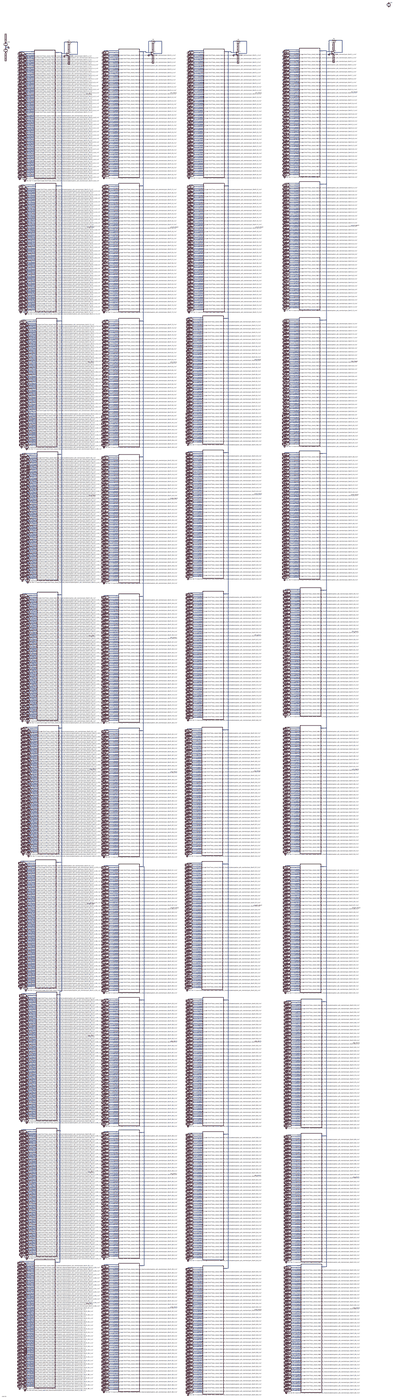
[diagram p0: schematic bangla_font_pattern.asc, whole sheet]
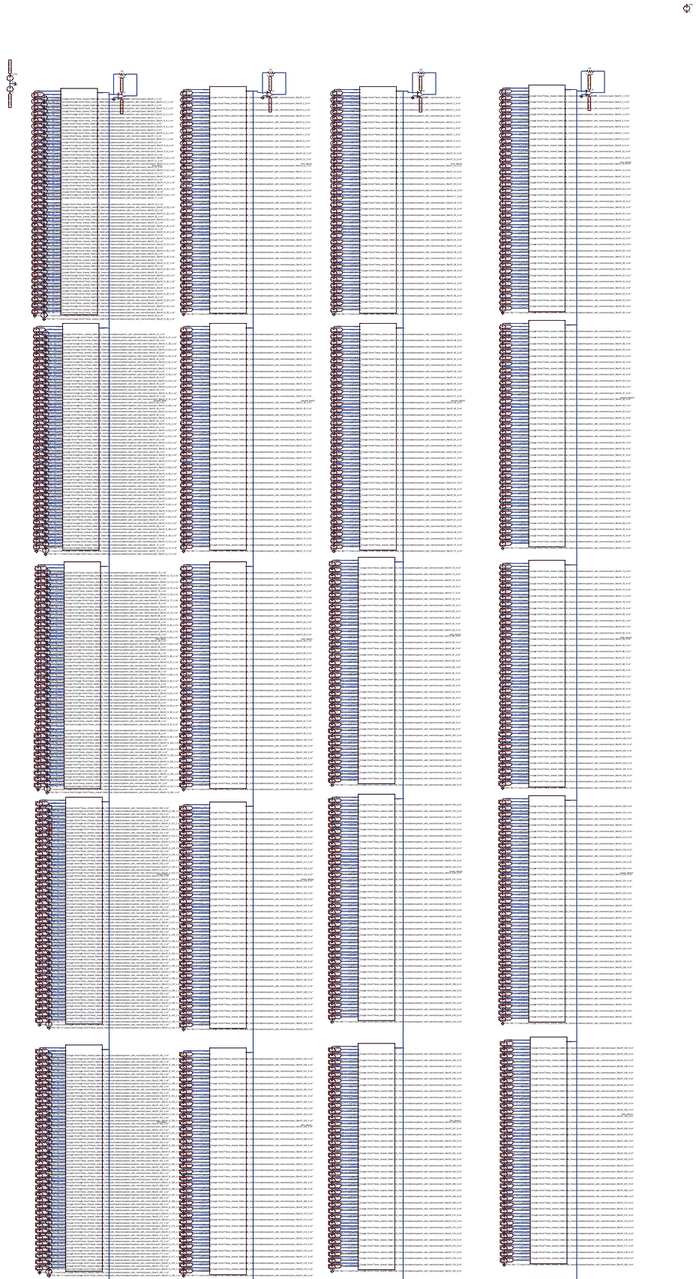
[diagram p1: schematic bangla_font_pattern.asc, part, row 1 of 2, column 1 of 1]
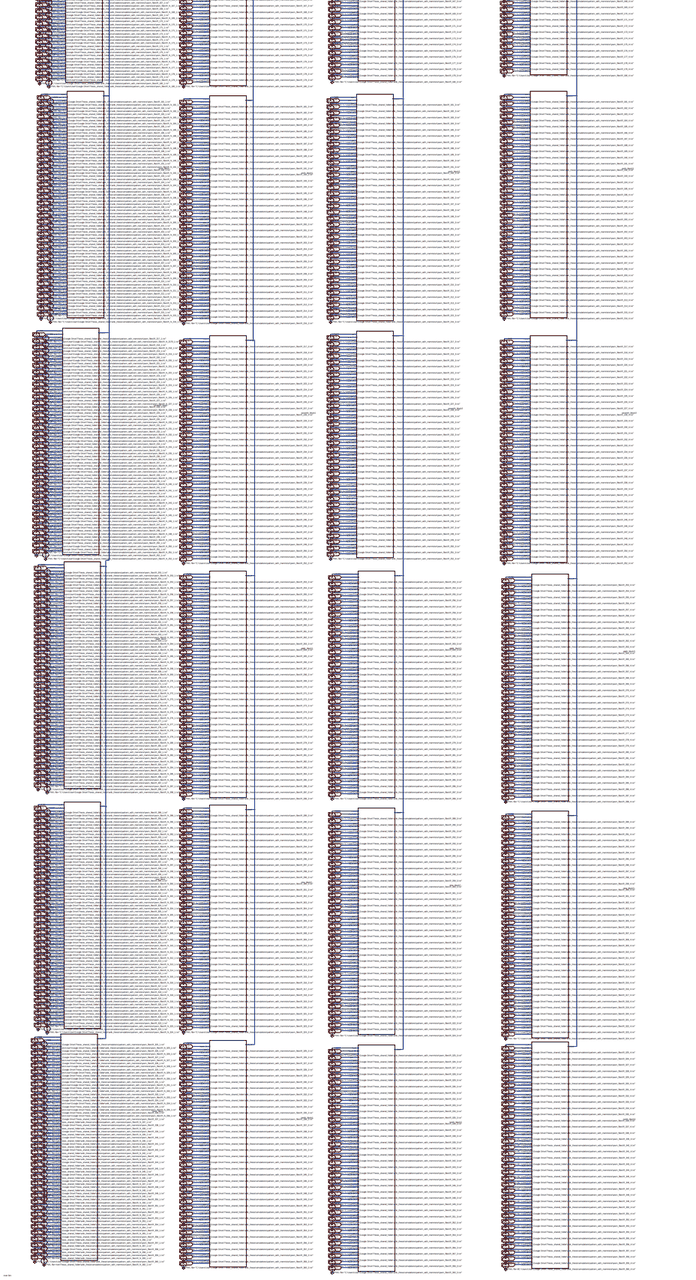
[diagram p2: schematic bangla_font_pattern.asc, part, row 2 of 2, column 1 of 1]
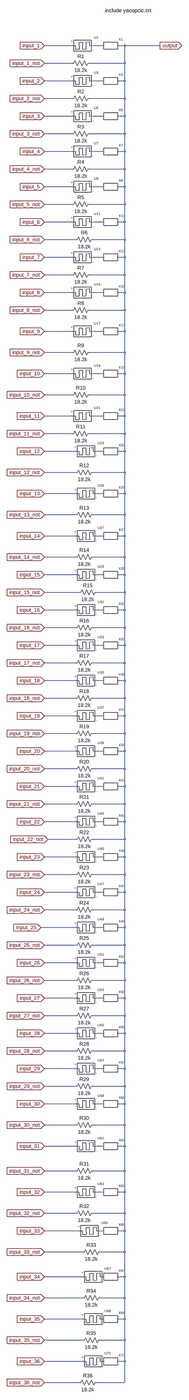
[diagram p3: sub-circuit memristor_block.asc, whole sheet]
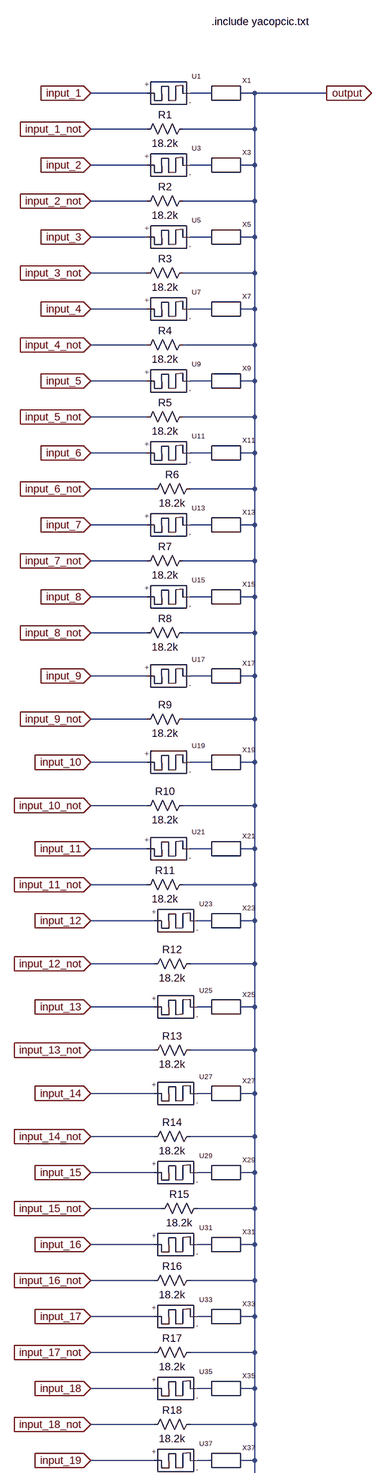
[diagram p4: sub-circuit memristor_block.asc, part, row 1 of 2, column 1 of 1]
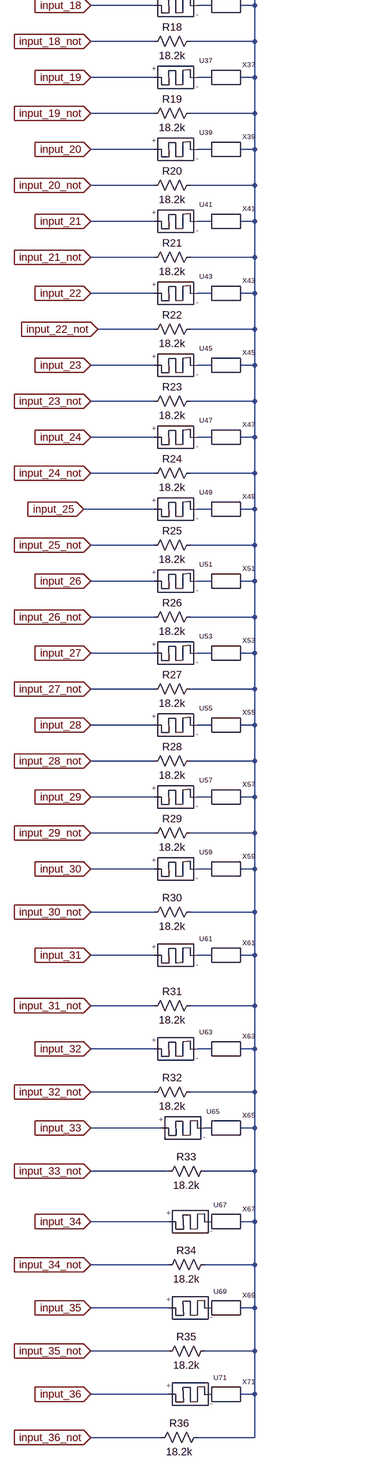
[diagram p5: sub-circuit memristor_block.asc, part, row 2 of 2, column 1 of 1]
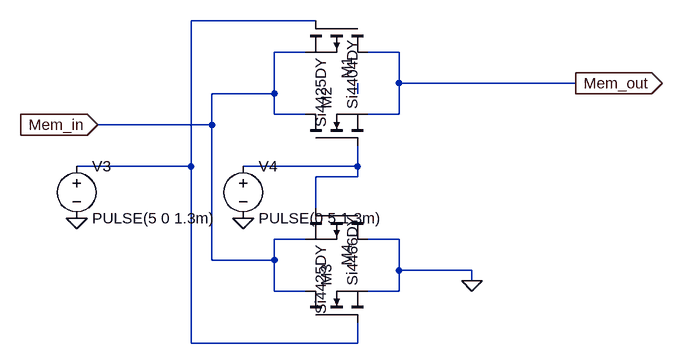
[diagram p6: sub-circuit programmer_with_transmission.asc]
* bangla_font_pattern.asc
Xfirst_block N012 351_NOT N016 2_NOT N020 3_NOT N024 4_NOT N028 5_NOT N032 6_NOT N036 7_NOT N040 8_NOT N007 N044 9_NOT N048 10_NOT N052 11_NOT N056 12_NOT N060 13_NOT N064 14_NOT N068 15_NOT N072 16_NOT N076 17_NOT N080 18_NOT N084 19_NOT N088 20_NOT N092 21_NOT N096 22_NOT N100 23_NOT N104 24_NOT N108 25_NOT N112 26_NOT N116 27_NOT N120 28_NOT N124 29_NOT N128 30_NOT N132 31_NOT N136 32_NOT N140 33_NOT N144 34_NOT N148 35_NOT N152 36_NOT memristor_block
V1 N012 0 PWL file="C:\Users\Anik\Google Drive\Thesis_shared_folder\anik_thesis\simulations\pattern_with_memristor\pwm_files\R_1_1.txt"
V2 351_NOT 0 PWL file="C:\Users\Anik\Google Drive\Thesis_shared_folder\anik_thesis\simulations\pattern_with_memristor\pwm_files\R_N_1_1.txt"
V3 N016 0 PWL file="C:\Users\Anik\Google Drive\Thesis_shared_folder\anik_thesis\simulations\pattern_with_memristor\pwm_files\R_2_1.txt"
V4 2_NOT 0 PWL file="C:\Users\Anik\Google Drive\Thesis_shared_folder\anik_thesis\simulations\pattern_with_memristor\pwm_files\R_N_2_1.txt"
V5 N020 0 PWL file="C:\Users\Anik\Google Drive\Thesis_shared_folder\anik_thesis\simulations\pattern_with_memristor\pwm_files\R_3_1.txt"
V6 3_NOT 0 PWL file="C:\Users\Anik\Google Drive\Thesis_shared_folder\anik_thesis\simulations\pattern_with_memristor\pwm_files\R_N_3_1.txt"
V7 N024 0 PWL file="C:\Users\Anik\Google Drive\Thesis_shared_folder\anik_thesis\simulations\pattern_with_memristor\pwm_files\R_4_1.txt"
V8 4_NOT 0 PWL file="C:\Users\Anik\Google Drive\Thesis_shared_folder\anik_thesis\simulations\pattern_with_memristor\pwm_files\R_N_4_1.txt"
V9 N028 0 PWL file="C:\Users\Anik\Google Drive\Thesis_shared_folder\anik_thesis\simulations\pattern_with_memristor\pwm_files\R_5_1.txt"
V10 5_NOT 0 PWL file="C:\Users\Anik\Google Drive\Thesis_shared_folder\anik_thesis\simulations\pattern_with_memristor\pwm_files\R_N_5_1.txt"
V11 N032 0 PWL file="C:\Users\Anik\Google Drive\Thesis_shared_folder\anik_thesis\simulations\pattern_with_memristor\pwm_files\R_6_1.txt"
V12 6_NOT 0 PWL file="C:\Users\Anik\Google Drive\Thesis_shared_folder\anik_thesis\simulations\pattern_with_memristor\pwm_files\R_N_6_1.txt"
V13 N036 0 PWL file="C:\Users\Anik\Google Drive\Thesis_shared_folder\anik_thesis\simulations\pattern_with_memristor\pwm_files\R_7_1.txt"
V14 7_NOT 0 PWL file="C:\Users\Anik\Google Drive\Thesis_shared_folder\anik_thesis\simulations\pattern_with_memristor\pwm_files\R_N_7_1.txt"
V15 N040 0 PWL file="C:\Users\Anik\Google Drive\Thesis_shared_folder\anik_thesis\simulations\pattern_with_memristor\pwm_files\R_8_1.txt"
V16 8_NOT 0 PWL file="C:\Users\User\Google Drive\Thesis_shared_folder\anik_thesis\simulations\pattern_with_memristor\pwm_files\R_N_8_1.txt"
V17 N044 0 PWL file="C:\Users\Anik\Google Drive\Thesis_shared_folder\anik_thesis\simulations\pattern_with_memristor\pwm_files\R_9_1.txt"
V18 9_NOT 0 PWL file="C:\Users\User\Google Drive\Thesis_shared_folder\anik_thesis\simulations\pattern_with_memristor\pwm_files\R_N_9_1.txt"
V19 N048 0 PWL file="C:\Users\Anik\Google Drive\Thesis_shared_folder\anik_thesis\simulations\pattern_with_memristor\pwm_files\R_10_1.txt"
V20 10_NOT 0 PWL file="C:\Users\User\Google Drive\Thesis_shared_folder\anik_thesis\simulations\pattern_with_memristor\pwm_files\R_N_10_1.txt"
V21 N052 0 PWL file="C:\Users\Anik\Google Drive\Thesis_shared_folder\anik_thesis\simulations\pattern_with_memristor\pwm_files\R_11_1.txt"
V22 11_NOT 0 PWL file="C:\Users\User\Google Drive\Thesis_shared_folder\anik_thesis\simulations\pattern_with_memristor\pwm_files\R_N_11_1.txt"
V23 N056 0 PWL file="C:\Users\Anik\Google Drive\Thesis_shared_folder\anik_thesis\simulations\pattern_with_memristor\pwm_files\R_12_1.txt"
V24 12_NOT 0 PWL file="C:\Users\User\Google Drive\Thesis_shared_folder\anik_thesis\simulations\pattern_with_memristor\pwm_files\R_N_12_1.txt"
V25 N060 0 PWL file="C:\Users\Anik\Google Drive\Thesis_shared_folder\anik_thesis\simulations\pattern_with_memristor\pwm_files\R_13_1.txt"
V26 13_NOT 0 PWL file="C:\Users\User\Google Drive\Thesis_shared_folder\anik_thesis\simulations\pattern_with_memristor\pwm_files\R_N_13_1.txt"
V27 N064 0 PWL file="C:\Users\Anik\Google Drive\Thesis_shared_folder\anik_thesis\simulations\pattern_with_memristor\pwm_files\R_14_1.txt"
V28 14_NOT 0 PWL file="C:\Users\User\Google Drive\Thesis_shared_folder\anik_thesis\simulations\pattern_with_memristor\pwm_files\R_N_14_1.txt"
V29 N068 NC_01 PWL file="C:\Users\Anik\Google Drive\Thesis_shared_folder\anik_thesis\simulations\pattern_with_memristor\pwm_files\R_15_1.txt"
V30 15_NOT NC_02 PWL file="C:\Users\User\Google Drive\Thesis_shared_folder\anik_thesis\simulations\pattern_with_memristor\pwm_files\R_N_15_1.txt"
V31 N072 0 PWL file="C:\Users\User\Google Drive\Thesis_shared_folder\anik_thesis\simulations\pattern_with_memristor\pwm_files\R_16_1.txt"
V32 16_NOT 0 PWL file="C:\Users\User\Google Drive\Thesis_shared_folder\anik_thesis\simulations\pattern_with_memristor\pwm_files\R_N_16_1.txt"
V33 N076 0 PWL file="C:\Users\User\Google Drive\Thesis_shared_folder\anik_thesis\simulations\pattern_with_memristor\pwm_files\R_17_1.txt"
V34 17_NOT 0 V
V35 N080 NC_03 PWL file="C:\Users\User\Google Drive\Thesis_shared_folder\anik_thesis\simulations\pattern_with_memristor\pwm_files\R_18_1.txt"
V36 18_NOT 0 PWL file="C:\Users\User\Google Drive\Thesis_shared_folder\anik_thesis\simulations\pattern_with_memristor\pwm_files\R_N_18_1.txt"
V37 N084 0 PWL file="C:\Users\User\Google Drive\Thesis_shared_folder\anik_thesis\simulations\pattern_with_memristor\pwm_files\R_19_1.txt"
V38 19_NOT 0 PWL file="C:\Users\User\Google Drive\Thesis_shared_folder\anik_thesis\simulations\pattern_with_memristor\pwm_files\R_N_19_1.txt"
V39 N088 0 PWL file="C:\Users\User\Google Drive\Thesis_shared_folder\anik_thesis\simulations\pattern_with_memristor\pwm_files\R_20_1.txt"
V40 20_NOT 0 PWL file="C:\Users\User\Google Drive\Thesis_shared_folder\anik_thesis\simulations\pattern_with_memristor\pwm_files\R_N_20_1.txt"
V41 N092 0 PWL file="C:\Users\User\Google Drive\Thesis_shared_folder\anik_thesis\simulations\pattern_with_memristor\pwm_files\R_21_1.txt"
V42 21_NOT 0 PWL file="C:\Users\User\Google Drive\Thesis_shared_folder\anik_thesis\simulations\pattern_with_memristor\pwm_files\R_N_21_1.txt"
V43 N096 0 PWL file="C:\Users\User\Google Drive\Thesis_shared_folder\anik_thesis\simulations\pattern_with_memristor\pwm_files\R_22_1.txt"
V44 22_NOT 0 PWL file="C:\Users\User\Google Drive\Thesis_shared_folder\anik_thesis\simulations\pattern_with_memristor\pwm_files\R_N_22_1.txt"
V45 N100 0 PWL file="C:\Users\User\Google Drive\Thesis_shared_folder\anik_thesis\simulations\pattern_with_memristor\pwm_files\R_23_1.txt"
V46 23_NOT 0 PWL file="C:\Users\User\Google Drive\Thesis_shared_folder\anik_thesis\simulations\pattern_with_memristor\pwm_files\R_N_23_1.txt"
V47 N104 0 PWL file="C:\Users\User\Google Drive\Thesis_shared_folder\anik_thesis\simulations\pattern_with_memristor\pwm_files\R_24_1.txt"
V48 24_NOT 0 PWL file="C:\Users\User\Google Drive\Thesis_shared_folder\anik_thesis\simulations\pattern_with_memristor\pwm_files\R_N_24_1.txt"
V49 N108 0 PWL file="C:\Users\User\Google Drive\Thesis_shared_folder\anik_thesis\simulations\pattern_with_memristor\pwm_files\R_25_1.txt"
V50 25_NOT 0 PWL file="C:\Users\User\Google Drive\Thesis_shared_folder\anik_thesis\simulations\pattern_with_memristor\pwm_files\R_N_25_1.txt"
V51 N112 0 PWL file="C:\Users\User\Google Drive\Thesis_shared_folder\anik_thesis\simulations\pattern_with_memristor\pwm_files\R_26_1.txt"
V52 26_NOT 0 PWL file="C:\Users\User\Google Drive\Thesis_shared_folder\anik_thesis\simulations\pattern_with_memristor\pwm_files\R_N_26_1.txt"
V53 N116 0 PWL file="C:\Users\User\Google Drive\Thesis_shared_folder\anik_thesis\simulations\pattern_with_memristor\pwm_files\R_27_1.txt"
V54 27_NOT 0 PWL file="C:\Users\User\Google Drive\Thesis_shared_folder\anik_thesis\simulations\pattern_with_memristor\pwm_files\R_N_27_1.txt"
V55 N120 0 PWL file="C:\Users\User\Google Drive\Thesis_shared_folder\anik_thesis\simulations\pattern_with_memristor\pwm_files\R_28_1.txt"
V56 28_NOT 0 PWL file="C:\Users\User\Google Drive\Thesis_shared_folder\anik_thesis\simulations\pattern_with_memristor\pwm_files\R_N_28_1.txt"
V57 N124 0 PWL file="C:\Users\User\Google Drive\Thesis_shared_folder\anik_thesis\simulations\pattern_with_memristor\pwm_files\R_29_1.txt"
V58 29_NOT 0 PWL file="C:\Users\User\Google Drive\Thesis_shared_folder\anik_thesis\simulations\pattern_with_memristor\pwm_files\R_N_29_1.txt"
V59 N128 0 PWL file="C:\Users\User\Google Drive\Thesis_shared_folder\anik_thesis\simulations\pattern_with_memristor\pwm_files\R_30_1.txt"
V60 30_NOT 0 PWL file="C:\Users\User\Google Drive\Thesis_shared_folder\anik_thesis\simulations\pattern_with_memristor\pwm_files\R_N_30_1.txt"
V61 N132 0 PWL file="C:\Users\User\Google Drive\Thesis_shared_folder\anik_thesis\simulations\pattern_with_memristor\pwm_files\R_31_1.txt"
V62 31_NOT 0 PWL file="C:\Users\User\Google Drive\Thesis_shared_folder\anik_thesis\simulations\pattern_with_memristor\pwm_files\R_N_31_1.txt"
V63 N136 0 PWL file="C:\Users\User\Google Drive\Thesis_shared_folder\anik_thesis\simulations\pattern_with_memristor\pwm_files\R_32_1.txt"
V64 32_NOT 0 PWL file="C:\Users\User\Google Drive\Thesis_shared_folder\anik_thesis\simulations\pattern_with_memristor\pwm_files\R_N_32_1.txt"
V65 N140 0 PWL file="C:\Users\User\Google Drive\Thesis_shared_folder\anik_thesis\simulations\pattern_with_memristor\pwm_files\R_33_1.txt"
V66 33_NOT 0 PWL file="C:\Users\User\Google Drive\Thesis_shared_folder\anik_thesis\simulations\pattern_with_memristor\pwm_files\R_N_33_1.txt"
V67 N144 0 PWL file="C:\Users\User\Google Drive\Thesis_shared_folder\anik_thesis\simulations\pattern_with_memristor\pwm_files\R_34_1.txt"
V68 34_NOT 0 PWL file="C:\Users\User\Google Drive\Thesis_shared_folder\anik_thesis\simulations\pattern_with_memristor\pwm_files\R_N_34_1.txt"
V69 NC_04 NC_05 V
V70 N148 0 PWL file="C:\Users\User\Google Drive\Thesis_shared_folder\anik_thesis\simulations\pattern_with_memristor\pwm_files\R_35_1.txt"
V71 35_NOT 0 PWL file="C:\Users\User\Google Drive\Thesis_shared_folder\anik_thesis\simulations\pattern_with_memristor\pwm_files\R_N_35_1.txt"
V72 N152 0 PWL file="C:\Users\User\Google Drive\Thesis_shared_folder\anik_thesis\simulations\pattern_with_memristor\pwm_files\R_36_1.txt"
V73 36_NOT 0 PWL file="C:\Users\User\Google Drive\Thesis_shared_folder\anik_thesis\simulations\pattern_with_memristor\pwm_files\R_N_36_1.txt"
Xsecond_block N154 37_NOT N158 38_NOT N162 39_NOT N166 40_NOT N170 41_NOT N174 42_NOT N178 43_NOT N182 44_NOT N007 N186 45_NOT N190 46_NOT N194 47_NOT N198 48_NOT N202 49_NOT N206 50_NOT N210 51_NOT N214 52_NOT N218 53_NOT N222 54_NOT N226 55_NOT N230 56_NOT N234 57_NOT N238 58_NOT N242 59_NOT N246 60_NOT N250 61_NOT N254 62_NOT N258 63_NOT N262 64_NOT N266 65_NOT N270 66_NOT N274 67_NOT N278 68_NOT N282 69_NOT N286 70_NOT N290 71_NOT N294 72_NOT memristor_block
V74 N154 0 PWL file="C:\Users\User\Google Drive\Thesis_shared_folder\anik_thesis\simulations\pattern_with_memristor\pwm_files\R_37_1.txt"
V75 37_NOT 0 PWL file="C:\Users\User\Google Drive\Thesis_shared_folder\anik_thesis\simulations\pattern_with_memristor\pwm_files\R_N_37_1.txt"
V76 N158 0 PWL file="C:\Users\User\Google Drive\Thesis_shared_folder\anik_thesis\simulations\pattern_with_memristor\pwm_files\R_38_1.txt"
V77 38_NOT 0 PWL file="C:\Users\User\Google Drive\Thesis_shared_folder\anik_thesis\simulations\pattern_with_memristor\pwm_files\R_N_38_1.txt"
V78 N162 0 PWL file="C:\Users\User\Google Drive\Thesis_shared_folder\anik_thesis\simulations\pattern_with_memristor\pwm_files\R_39_1.txt"
V79 39_NOT 0 PWL file="C:\Users\User\Google Drive\Thesis_shared_folder\anik_thesis\simulations\pattern_with_memristor\pwm_files\R_N_39_1.txt"
V80 N166 0 PWL file="C:\Users\User\Google Drive\Thesis_shared_folder\anik_thesis\simulations\pattern_with_memristor\pwm_files\R_40_1.txt"
V81 40_NOT 0 PWL file="C:\Users\User\Google Drive\Thesis_shared_folder\anik_thesis\simulations\pattern_with_memristor\pwm_files\R_N_40_1.txt"
V82 N170 0 PWL file="C:\Users\User\Google Drive\Thesis_shared_folder\anik_thesis\simulations\pattern_with_memristor\pwm_files\R_41_1.txt"
V83 41_NOT 0 PWL file="C:\Users\User\Google Drive\Thesis_shared_folder\anik_thesis\simulations\pattern_with_memristor\pwm_files\R_N_41_1.txt"
V84 N174 0 PWL file="C:\Users\User\Google Drive\Thesis_shared_folder\anik_thesis\simulations\pattern_with_memristor\pwm_files\R_42_1.txt"
V85 42_NOT 0 PWL file="C:\Users\User\Google Drive\Thesis_shared_folder\anik_thesis\simulations\pattern_with_memristor\pwm_files\R_N_42_1.txt"
V86 N178 0 PWL file="C:\Users\User\Google Drive\Thesis_shared_folder\anik_thesis\simulations\pattern_with_memristor\pwm_files\R_43_1.txt"
V87 43_NOT 0 PWL file="C:\Users\User\Google Drive\Thesis_shared_folder\anik_thesis\simulations\pattern_with_memristor\pwm_files\R_N_43_1.txt"
V88 N182 0 PWL file="C:\Users\User\Google Drive\Thesis_shared_folder\anik_thesis\simulations\pattern_with_memristor\pwm_files\R_44_1.txt"
V89 44_NOT 0 PWL file="C:\Users\User\Google Drive\Thesis_shared_folder\anik_thesis\simulations\pattern_with_memristor\pwm_files\R_N_44_1.txt"
V90 N186 0 PWL file="C:\Users\User\Google Drive\Thesis_shared_folder\anik_thesis\simulations\pattern_with_memristor\pwm_files\R_45_1.txt"
V91 45_NOT 0 PWL file="C:\Users\User\Google Drive\Thesis_shared_folder\anik_thesis\simulations\pattern_with_memristor\pwm_files\R_N_45_1.txt"
V92 N190 0 PWL file="C:\Users\User\Google Drive\Thesis_shared_folder\anik_thesis\simulations\pattern_with_memristor\pwm_files\R_46_1.txt"
V93 46_NOT 0 PWL file="C:\Users\User\Google Drive\Thesis_shared_folder\anik_thesis\simulations\pattern_with_memristor\pwm_files\R_N_46_1.txt"
V94 N194 0 PWL file="C:\Users\User\Google Drive\Thesis_shared_folder\anik_thesis\simulations\pattern_with_memristor\pwm_files\R_4\7_1.txt"
V95 47_NOT 0 PWL file="C:\Users\User\Google Drive\Thesis_shared_folder\anik_thesis\simulations\pattern_with_memristor\pwm_files\R_N_47_1.txt"
V96 N198 0 PWL file="C:\Users\User\Google Drive\Thesis_shared_folder\anik_thesis\simulations\pattern_with_memristor\pwm_files\R_48_1.txt"
V97 48_NOT 0 PWL file="C:\Users\User\Google Drive\Thesis_shared_folder\anik_thesis\simulations\pattern_with_memristor\pwm_files\R_N_48_1.txt"
V98 N202 0 PWL file="C:\Users\User\Google Drive\Thesis_shared_folder\anik_thesis\simulations\pattern_with_memristor\pwm_files\R_49_1.txt"
V99 49_NOT 0 PWL file="C:\Users\User\Google Drive\Thesis_shared_folder\anik_thesis\simulations\pattern_with_memristor\pwm_files\R_N_49_1.txt"
V100 N206 0 PWL file="C:\Users\User\Google Drive\Thesis_shared_folder\anik_thesis\simulations\pattern_with_memristor\pwm_files\R_50_1.txt"
V101 50_NOT 0 PWL file="C:\Users\User\Google Drive\Thesis_shared_folder\anik_thesis\simulations\pattern_with_memristor\pwm_files\R_N_50_1.txt"
V102 N210 NC_06 PWL file="C:\Users\User\Google Drive\Thesis_shared_folder\anik_thesis\simulations\pattern_with_memristor\pwm_files\R_51_1.txt"
V103 51_NOT NC_07 PWL file="C:\Users\User\Google Drive\Thesis_shared_folder\anik_thesis\simulations\pattern_with_memristor\pwm_files\R_N_51_1.txt"
V104 N214 0 PWL file="C:\Users\User\Google Drive\Thesis_shared_folder\anik_thesis\simulations\pattern_with_memristor\pwm_files\R_52_1.txt"
V105 52_NOT 0 PWL file="C:\Users\User\Google Drive\Thesis_shared_folder\anik_thesis\simulations\pattern_with_memristor\pwm_files\R_N_52_1.txt"
V106 N218 0 PWL file="C:\Users\User\Google Drive\Thesis_shared_folder\anik_thesis\simulations\pattern_with_memristor\pwm_files\R_53_1.txt"
V107 53_NOT 0 PWL file="C:\Users\User\Google Drive\Thesis_shared_folder\anik_thesis\simulations\pattern_with_memristor\pwm_files\R_N_53_1.txt"
V108 N222 NC_08 PWL file="C:\Users\User\Google Drive\Thesis_shared_folder\anik_thesis\simulations\pattern_with_memristor\pwm_files\R_54_1.txt"
V109 54_NOT 0 PWL file="C:\Users\User\Google Drive\Thesis_shared_folder\anik_thesis\simulations\pattern_with_memristor\pwm_files\R_N_54_1.txt"
V110 N226 0 PWL file="C:\Users\User\Google Drive\Thesis_shared_folder\anik_thesis\simulations\pattern_with_memristor\pwm_files\R_55_1.txt"
V111 55_NOT 0 PWL file="C:\Users\User\Google Drive\Thesis_shared_folder\anik_thesis\simulations\pattern_with_memristor\pwm_files\R_N_55_1.txt"
V112 N230 0 PWL file="C:\Users\User\Google Drive\Thesis_shared_folder\anik_thesis\simulations\pattern_with_memristor\pwm_files\R_56_1.txt"
V113 56_NOT 0 PWL file="C:\Users\User\Google Drive\Thesis_shared_folder\anik_thesis\simulations\pattern_with_memristor\pwm_files\R_N_56_1.txt"
V114 N234 0 PWL file="C:\Users\User\Google Drive\Thesis_shared_folder\anik_thesis\simulations\pattern_with_memristor\pwm_files\R_57_1.txt"
V115 57_NOT 0 PWL file="C:\Users\User\Google Drive\Thesis_shared_folder\anik_thesis\simulations\pattern_with_memristor\pwm_files\R_N_57_1.txt"
V116 N238 0 PWL file="C:\Users\User\Google Drive\Thesis_shared_folder\anik_thesis\simulations\pattern_with_memristor\pwm_files\R_58_1.txt"
V117 58_NOT 0 PWL file="C:\Users\User\Google Drive\Thesis_shared_folder\anik_thesis\simulations\pattern_with_memristor\pwm_files\R_N_58_1.txt"
V118 N242 0 PWL file="C:\Users\User\Google Drive\Thesis_shared_folder\anik_thesis\simulations\pattern_with_memristor\pwm_files\R_59_1.txt"
V119 59_NOT 0 PWL file="C:\Users\User\Google Drive\Thesis_shared_folder\anik_thesis\simulations\pattern_with_memristor\pwm_files\R_N_59_1.txt"
V120 N246 0 PWL file="C:\Users\User\Google Drive\Thesis_shared_folder\anik_thesis\simulations\pattern_with_memristor\pwm_files\R_60_1.txt"
V121 60_NOT 0 PWL file="C:\Users\User\Google Drive\Thesis_shared_folder\anik_thesis\simulations\pattern_with_memristor\pwm_files\R_N_60_1.txt"
V122 N250 0 PWL file="C:\Users\User\Google Drive\Thesis_shared_folder\anik_thesis\simulations\pattern_with_memristor\pwm_files\R_61_1.txt"
V123 61_NOT 0 PWL file="C:\Users\User\Google Drive\Thesis_shared_folder\anik_thesis\simulations\pattern_with_memristor\pwm_files\R_N_61_1.txt"
V124 N254 0 PWL file="C:\Users\User\Google Drive\Thesis_shared_folder\anik_thesis\simulations\pattern_with_memristor\pwm_files\R_62_1.txt"
V125 62_NOT 0 PWL file="C:\Users\User\Google Drive\Thesis_shared_folder\anik_thesis\simulations\pattern_with_memristor\pwm_files\R_N_62_1.txt"
V126 N258 0 PWL file="C:\Users\User\Google Drive\Thesis_shared_folder\anik_thesis\simulations\pattern_with_memristor\pwm_files\R_63_1.txt"
V127 63_NOT 0 PWL file="C:\Users\User\Google Drive\Thesis_shared_folder\anik_thesis\simulations\pattern_with_memristor\pwm_files\R_N_63_1.txt"
V128 N262 0 PWL file="C:\Users\User\Google Drive\Thesis_shared_folder\anik_thesis\simulations\pattern_with_memristor\pwm_files\R_64_1.txt"
V129 64_NOT 0 PWL file="C:\Users\User\Google Drive\Thesis_shared_folder\anik_thesis\simulations\pattern_with_memristor\pwm_files\R_N_64_1.txt"
V130 N266 0 PWL file="C:\Users\User\Google Drive\Thesis_shared_folder\anik_thesis\simulations\pattern_with_memristor\pwm_files\R_65_1.txt"
V131 65_NOT 0 PWL file="C:\Users\User\Google Drive\Thesis_shared_folder\anik_thesis\simulations\pattern_with_memristor\pwm_files\R_N_64_1.txt"
V132 N270 0 PWL file="C:\Users\User\Google Drive\Thesis_shared_folder\anik_thesis\simulations\pattern_with_memristor\pwm_files\R_66_1.txt"
V133 66_NOT 0 PWL file="C:\Users\User\Google Drive\Thesis_shared_folder\anik_thesis\simulations\pattern_with_memristor\pwm_files\R_N_66_1.txt"
V134 N274 0 PWL file="C:\Users\User\Google Drive\Thesis_shared_folder\anik_thesis\simulations\pattern_with_memristor\pwm_files\R_67_1.txt"
V135 67_NOT 0 PWL file="C:\Users\User\Google Drive\Thesis_shared_folder\anik_thesis\simulations\pattern_with_memristor\pwm_files\R_N_67_1.txt"
V136 N278 0 PWL file="C:\Users\User\Google Drive\Thesis_shared_folder\anik_thesis\simulations\pattern_with_memristor\pwm_files\R_68_1.txt"
V137 68_NOT 0 PWL file="C:\Users\User\Google Drive\Thesis_shared_folder\anik_thesis\simulations\pattern_with_memristor\pwm_files\R_N_68_1.txt"
V138 N282 0 PWL file="C:\Users\User\Google Drive\Thesis_shared_folder\anik_thesis\simulations\pattern_with_memristor\pwm_files\R_69_1.txt"
V139 69_NOT 0 PWL file="C:\Users\User\Google Drive\Thesis_shared_folder\anik_thesis\simulations\pattern_with_memristor\pwm_files\R_N_69_1.txt"
V140 N286 0 PWL file="C:\Users\User\Google Drive\Thesis_shared_folder\anik_thesis\simulations\pattern_with_memristor\pwm_files\R_70_1.txt"
V141 70_NOT 0 PWL file="C:\Users\User\Google Drive\Thesis_shared_folder\anik_thesis\simulations\pattern_with_memristor\pwm_files\R_N_70_1.txt"
V142 N290 0 PWL file="C:\Users\User\Google Drive\Thesis_shared_folder\anik_thesis\simulations\pattern_with_memristor\pwm_files\R_71_1.txt"
V143 71_NOT 0 PWL file="C:\Users\User\Google Drive\Thesis_shared_folder\anik_thesis\simulations\pattern_with_memristor\pwm_files\R_N_71_1.txt"
V144 N294 0 PWL file="C:\Users\User\Google Drive\Thesis_shared_folder\anik_thesis\simulations\pattern_with_memristor\pwm_files\R_72_1.txt"
V145 72_NOT 0 PWL file="C:\Users\User\Google Drive\Thesis_shared_folder\anik_thesis\simulations\pattern_with_memristor\pwm_files\R_N_72_1.txt"
Xthird_block N299 73_NOT N303 74_NOT N307 75_NOT N311 76_NOT N315 77_NOT N319 78_NOT N323 79_NOT N327 80_NOT N007 N331 81_NOT N335 82_NOT N339 83_NOT N343 84_NOT N347 85_NOT N351 86_NOT N355 87_NOT N359 88_NOT N363 89_NOT N367 90_NOT N371 91_NOT N375 92_NOT N379 93_NOT N383 94_NOT N387 95_NOT N391 96_NOT N395 97_NOT N399 98_NOT N403 99_NOT N407 100_NOT N411 101_NOT N415 102_NOT N419 103_NOT N423 104_NOT N427 105_NOT N431 106_NOT N435 107_NOT N439 108_NOT memristor_block
V146 N299 0 PWL file="C:\Users\User\Google Drive\Thesis_shared_folder\anik_thesis\simulations\pattern_with_memristor\pwm_files\R_73_1.txt"
V147 73_NOT 0 PWL file="C:\Users\User\Google Drive\Thesis_shared_folder\anik_thesis\simulations\pattern_with_memristor\pwm_files\R_N_73_1.txt"
V148 N303 0 PWL file="C:\Users\User\Google Drive\Thesis_shared_folder\anik_thesis\simulations\pattern_with_memristor\pwm_files\R_74_1.txt"
V149 74_NOT 0 PWL file="C:\Users\User\Google Drive\Thesis_shared_folder\anik_thesis\simulations\pattern_with_memristor\pwm_files\R_N_74_1.txt"
V150 N307 0 PWL file="C:\Users\User\Google Drive\Thesis_shared_folder\anik_thesis\simulations\pattern_with_memristor\pwm_files\R_75_1.txt"
V151 75_NOT 0 PWL file="C:\Users\User\Google Drive\Thesis_shared_folder\anik_thesis\simulations\pattern_with_memristor\pwm_files\R_N_75_1.txt"
V152 N311 0 PWL file="C:\Users\User\Google Drive\Thesis_shared_folder\anik_thesis\simulations\pattern_with_memristor\pwm_files\R_76_1.txt"
V153 76_NOT 0 PWL file="C:\Users\User\Google Drive\Thesis_shared_folder\anik_thesis\simulations\pattern_with_memristor\pwm_files\R_N_76_1.txt"
V154 N315 0 PWL file="C:\Users\User\Google Drive\Thesis_shared_folder\anik_thesis\simulations\pattern_with_memristor\pwm_files\R_77_1.txt"
V155 77_NOT 0 PWL file="C:\Users\User\Google Drive\Thesis_shared_folder\anik_thesis\simulations\pattern_with_memristor\pwm_files\R_N_77_1.txt"
V156 N319 0 PWL file="C:\Users\User\Google Drive\Thesis_shared_folder\anik_thesis\simulations\pattern_with_memristor\pwm_files\R_78_1.txt"
V157 78_NOT 0 PWL file="C:\Users\User\Google Drive\Thesis_shared_folder\anik_thesis\simulations\pattern_with_memristor\pwm_files\R_N_76_1.txt"
V158 N323 0 PWL file="C:\Users\User\Google Drive\Thesis_shared_folder\anik_thesis\simulations\pattern_with_memristor\pwm_files\R_79_1.txt"
V159 79_NOT 0 PWL file="C:\Users\User\Google Drive\Thesis_shared_folder\anik_thesis\simulations\pattern_with_memristor\pwm_files\R_N_79_1.txt"
V160 N327 0 PWL file="C:\Users\User\Google Drive\Thesis_shared_folder\anik_thesis\simulations\pattern_with_memristor\pwm_files\R_80_1.txt"
V161 80_NOT 0 PWL file="C:\Users\User\Google Drive\Thesis_shared_folder\anik_thesis\simulations\pattern_with_memristor\pwm_files\R_N_80_1.txt"
V162 N331 0 PWL file="C:\Users\User\Google Drive\Thesis_shared_folder\anik_thesis\simulations\pattern_with_memristor\pwm_files\R_81_1.txt"
V163 81_NOT 0 PWL file="C:\Users\User\Google Drive\Thesis_shared_folder\anik_thesis\simulations\pattern_with_memristor\pwm_files\R_N_81_1.txt"
V164 N335 0 PWL file="C:\Users\User\Google Drive\Thesis_shared_folder\anik_thesis\simulations\pattern_with_memristor\pwm_files\R_82_1.txt"
V165 82_NOT 0 PWL file="C:\Users\User\Google Drive\Thesis_shared_folder\anik_thesis\simulations\pattern_with_memristor\pwm_files\R_N_82_1.txt"
V166 N339 0 PWL file="C:\Users\User\Google Drive\Thesis_shared_folder\anik_thesis\simulations\pattern_with_memristor\pwm_files\R_83_1.txt"
V167 83_NOT 0 PWL file="C:\Users\User\Google Drive\Thesis_shared_folder\anik_thesis\simulations\pattern_with_memristor\pwm_files\R_N_83_1.txt"
V168 N343 0 PWL file="C:\Users\User\Google Drive\Thesis_shared_folder\anik_thesis\simulations\pattern_with_memristor\pwm_files\R_84_1.txt"
V169 84_NOT 0 PWL file="C:\Users\User\Google Drive\Thesis_shared_folder\anik_thesis\simulations\pattern_with_memristor\pwm_files\R_N_84_1.txt"
V170 N347 0 PWL file="C:\Users\User\Google Drive\Thesis_shared_folder\anik_thesis\simulations\pattern_with_memristor\pwm_files\R_85_1.txt"
V171 85_NOT 0 PWL file="C:\Users\User\Google Drive\Thesis_shared_folder\anik_thesis\simulations\pattern_with_memristor\pwm_files\R_N_85_1.txt"
V172 N351 0 PWL file="C:\Users\User\Google Drive\Thesis_shared_folder\anik_thesis\simulations\pattern_with_memristor\pwm_files\R_86_1.txt"
V173 86_NOT 0 PWL file="C:\Users\User\Google Drive\Thesis_shared_folder\anik_thesis\simulations\pattern_with_memristor\pwm_files\R_N_86_1.txt"
V174 N355 NC_09 PWL file="C:\Users\User\Google Drive\Thesis_shared_folder\anik_thesis\simulations\pattern_with_memristor\pwm_files\R_87_1.txt"
V175 87_NOT NC_10 PWL file="C:\Users\User\Google Drive\Thesis_shared_folder\anik_thesis\simulations\pattern_with_memristor\pwm_files\R_N_87_1.txt"
V176 N359 0 PWL file="C:\Users\User\Google Drive\Thesis_shared_folder\anik_thesis\simulations\pattern_with_memristor\pwm_files\R_88_1.txt"
V177 88_NOT 0 PWL file="C:\Users\User\Google Drive\Thesis_shared_folder\anik_thesis\simulations\pattern_with_memristor\pwm_files\R_N_88_1.txt"
V178 N363 0 PWL file="C:\Users\User\Google Drive\Thesis_shared_folder\anik_thesis\simulations\pattern_with_memristor\pwm_files\R_89_1.txt"
V179 89_NOT 0 PWL file="C:\Users\User\Google Drive\Thesis_shared_folder\anik_thesis\simulations\pattern_with_memristor\pwm_files\R_N_89_1.txt"
V180 N367 NC_11 PWL file="C:\Users\User\Google Drive\Thesis_shared_folder\anik_thesis\simulations\pattern_with_memristor\pwm_files\R_90_1.txt"
V181 90_NOT 0 PWL file="C:\Users\User\Google Drive\Thesis_shared_folder\anik_thesis\simulations\pattern_with_memristor\pwm_files\R_N_90_1.txt"
V182 N371 0 PWL file="C:\Users\User\Google Drive\Thesis_shared_folder\anik_thesis\simulations\pattern_with_memristor\pwm_files\R_91_1.txt"
V183 91_NOT 0 PWL file="C:\Users\User\Google Drive\Thesis_shared_folder\anik_thesis\simulations\pattern_with_memristor\pwm_files\R_N_91_1.txt"
V184 N375 0 PWL file="C:\Users\User\Google Drive\Thesis_shared_folder\anik_thesis\simulations\pattern_with_memristor\pwm_files\R_92_1.txt"
V185 92_NOT 0 PWL file="C:\Users\User\Google Drive\Thesis_shared_folder\anik_thesis\simulations\pattern_with_memristor\pwm_files\R_N_92_1.txt"
V186 N379 0 PWL file="C:\Users\User\Google Drive\Thesis_shared_folder\anik_thesis\simulations\pattern_with_memristor\pwm_files\R_93_1.txt"
V187 93_NOT 0 PWL file="C:\Users\User\Google Drive\Thesis_shared_folder\anik_thesis\simulations\pattern_with_memristor\pwm_files\R_N_93_1.txt"
V188 N383 0 PWL file="C:\Users\User\Google Drive\Thesis_shared_folder\anik_thesis\simulations\pattern_with_memristor\pwm_files\R_94_1.txt"
V189 94_NOT 0 PWL file="C:\Users\User\Google Drive\Thesis_shared_folder\anik_thesis\simulations\pattern_with_memristor\pwm_files\R_N_94_1.txt"
V190 N387 0 PWL file="C:\Users\User\Google Drive\Thesis_shared_folder\anik_thesis\simulations\pattern_with_memristor\pwm_files\R_95_1.txt"
V191 95_NOT 0 PWL file="C:\Users\User\Google Drive\Thesis_shared_folder\anik_thesis\simulations\pattern_with_memristor\pwm_files\R_N_95_1.txt"
V192 N391 0 PWL file="C:\Users\User\Google Drive\Thesis_shared_folder\anik_thesis\simulations\pattern_with_memristor\pwm_files\R_96_1.txt"
V193 96_NOT 0 PWL file="C:\Users\User\Google Drive\Thesis_shared_folder\anik_thesis\simulations\pattern_with_memristor\pwm_files\R_N_96_1.txt"
V194 N395 0 PWL file="C:\Users\User\Google Drive\Thesis_shared_folder\anik_thesis\simulations\pattern_with_memristor\pwm_files\R_98_1.txt"
V195 97_NOT 0 PWL file="C:\Users\User\Google Drive\Thesis_shared_folder\anik_thesis\simulations\pattern_with_memristor\pwm_files\R_N_97_1.txt"
V196 N399 0 V
V197 98_NOT 0 PWL file="C:\Users\User\Google Drive\Thesis_shared_folder\anik_thesis\simulations\pattern_with_memristor\pwm_files\R_N_98_1.txt"
V198 N403 0 PWL file="C:\Users\User\Google Drive\Thesis_shared_folder\anik_thesis\simulations\pattern_with_memristor\pwm_files\R_99_1.txt"
V199 99_NOT 0 PWL file="C:\Users\User\Google Drive\Thesis_shared_folder\anik_thesis\simulations\pattern_with_memristor\pwm_files\R_N_99_1.txt"
V200 N407 0 PWL file="C:\Users\User\Google Drive\Thesis_shared_folder\anik_thesis\simulations\pattern_with_memristor\pwm_files\R_100_1.txt"
V201 100_NOT 0 PWL file="C:\Users\User\Google Drive\Thesis_shared_folder\anik_thesis\simulations\pattern_with_memristor\pwm_files\R_N_100_1.txt"
V202 N411 0 PWL file="C:\Users\User\Google Drive\Thesis_shared_folder\anik_thesis\simulations\pattern_with_memristor\pwm_files\R_101_1.txt"
V203 101_NOT 0 PWL file="C:\Users\User\Google Drive\Thesis_shared_folder\anik_thesis\simulations\pattern_with_memristor\pwm_files\R_N_101_1.txt"
V204 N415 0 PWL file="C:\Users\User\Google Drive\Thesis_shared_folder\anik_thesis\simulations\pattern_with_memristor\pwm_files\R_102_1.txt"
V205 102_NOT 0 PWL file="C:\Users\User\Google Drive\Thesis_shared_folder\anik_thesis\simulations\pattern_with_memristor\pwm_files\R_N_102_1.txt"
V206 N419 0 PWL file="C:\Users\User\Google Drive\Thesis_shared_folder\anik_thesis\simulations\pattern_with_memristor\pwm_files\R_103_1.txt"
V207 103_NOT 0 PWL file="C:\Users\User\Google Drive\Thesis_shared_folder\anik_thesis\simulations\pattern_with_memristor\pwm_files\R_N_103_1.txt"
V208 N423 0 PWL file="C:\Users\User\Google Drive\Thesis_shared_folder\anik_thesis\simulations\pattern_with_memristor\pwm_files\R_104_1.txt"
V209 104_NOT 0 PWL file="C:\Users\User\Google Drive\Thesis_shared_folder\anik_thesis\simulations\pattern_with_memristor\pwm_files\R_N_104_1.txt"
V210 N427 0 PWL file="C:\Users\User\Google Drive\Thesis_shared_folder\anik_thesis\simulations\pattern_with_memristor\pwm_files\R_105_1.txt"
V211 105_NOT 0 PWL file="C:\Users\User\Google Drive\Thesis_shared_folder\anik_thesis\simulations\pattern_with_memristor\pwm_files\R_N_105_1.txt"
V212 N431 0 PWL file="C:\Users\User\Google Drive\Thesis_shared_folder\anik_thesis\simulations\pattern_with_memristor\pwm_files\R_106_1.txt"
V213 106_NOT 0 PWL file="C:\Users\User\Google Drive\Thesis_shared_folder\anik_thesis\simulations\pattern_with_memristor\pwm_files\R_N_106_1.txt"
V214 N435 0 PWL file="C:\Users\User\Google Drive\Thesis_shared_folder\anik_thesis\simulations\pattern_with_memristor\pwm_files\R_107_1.txt"
V215 107_NOT 0 PWL file="C:\Users\User\Google Drive\Thesis_shared_folder\anik_thesis\simulations\pattern_with_memristor\pwm_files\R_N_107_1.txt"
V216 N439 0 PWL file="C:\Users\User\Google Drive\Thesis_shared_folder\anik_thesis\simulations\pattern_with_memristor\pwm_files\R_108_1.txt"
V217 108_NOT 0 PWL file="C:\Users\User\Google Drive\Thesis_shared_folder\anik_thesis\simulations\pattern_with_memristor\pwm_files\R_N_108_1.txt"
Xfourth_block N443 109_NOT N447 110_NOT N451 111_NOT N455 112_NOT N459 113_NOT N463 351_NOT N467 115_NOT N471 116_NOT N007 N475 117_NOT N479 118_NOT N483 119_NOT N487 120_NOT N491 121_NOT N495 122_NOT N499 123_NOT N503 124_NOT N507 125_NOT N511 126_NOT N515 127_NOT N519 128_NOT N523 129_NOT N527 130_NOT N531 131_NOT N535 132_NOT N539 133_NOT N543 134_NOT N547 135_NOT N551 136_NOT N555 137_NOT N559 138_NOT N563 139_NOT N567 140_NOT N571 141_NOT N575 142_NOT N579 143_NOT N583 144_NOT memristor_block
V218 N443 0 PWL file="C:\Users\User\Google Drive\Thesis_shared_folder\anik_thesis\simulations\pattern_with_memristor\pwm_files\R_109_1.txt"
V219 109_NOT 0 PWL file="C:\Users\User\Google Drive\Thesis_shared_folder\anik_thesis\simulations\pattern_with_memristor\pwm_files\R_N_109_1.txt"
V220 N447 0 PWL file="C:\Users\User\Google Drive\Thesis_shared_folder\anik_thesis\simulations\pattern_with_memristor\pwm_files\R_110_1.txt"
V221 110_NOT 0 PWL file="C:\Users\User\Google Drive\Thesis_shared_folder\anik_thesis\simulations\pattern_with_memristor\pwm_files\R_N_110_1.txt"
V222 N451 0 PWL file="C:\Users\User\Google Drive\Thesis_shared_folder\anik_thesis\simulations\pattern_with_memristor\pwm_files\R_111_1.txt"
V223 111_NOT 0 PWL file="C:\Users\User\Google Drive\Thesis_shared_folder\anik_thesis\simulations\pattern_with_memristor\pwm_files\R_N_111_1.txt"
V224 N455 0 PWL file="C:\Users\User\Google Drive\Thesis_shared_folder\anik_thesis\simulations\pattern_with_memristor\pwm_files\R_112_1.txt"
V225 112_NOT 0 PWL file="C:\Users\User\Google Drive\Thesis_shared_folder\anik_thesis\simulations\pattern_with_memristor\pwm_files\R_N_112_1.txt"
V226 N459 0 PWL file="C:\Users\User\Google Drive\Thesis_shared_folder\anik_thesis\simulations\pattern_with_memristor\pwm_files\R_113_1.txt"
V227 113_NOT 0 PWL file="C:\Users\User\Google Drive\Thesis_shared_folder\anik_thesis\simulations\pattern_with_memristor\pwm_files\R_N_113_1.txt"
V228 N463 0 PWL file="C:\Users\User\Google Drive\Thesis_shared_folder\anik_thesis\simulations\pattern_with_memristor\pwm_files\R_114_1.txt"
V229 351_NOT 0 PWL file="C:\Users\User\Google Drive\Thesis_shared_folder\anik_thesis\simulations\pattern_with_memristor\pwm_files\R_N_114_1.txt"
V230 N467 0 PWL file="C:\Users\User\Google Drive\Thesis_shared_folder\anik_thesis\simulations\pattern_with_memristor\pwm_files\R_115_1.txt"
V231 115_NOT 0 PWL file="C:\Users\User\Google Drive\Thesis_shared_folder\anik_thesis\simulations\pattern_with_memristor\pwm_files\R_N_115_1.txt"
V232 N471 0 PWL file="C:\Users\User\Google Drive\Thesis_shared_folder\anik_thesis\simulations\pattern_with_memristor\pwm_files\R_116_1.txt"
V233 116_NOT 0 PWL file="C:\Users\User\Google Drive\Thesis_shared_folder\anik_thesis\simulations\pattern_with_memristor\pwm_files\R_N_116_1.txt"
V234 N475 0 PWL file="C:\Users\User\Google Drive\Thesis_shared_folder\anik_thesis\simulations\pattern_with_memristor\pwm_files\R_117_1.txt"
V235 117_NOT 0 PWL file="C:\Users\User\Google Drive\Thesis_shared_folder\anik_thesis\simulations\pattern_with_memristor\pwm_files\R_N_117_1.txt"
V236 N479 0 PWL file="C:\Users\User\Google Drive\Thesis_shared_folder\anik_thesis\simulations\pattern_with_memristor\pwm_files\R_118_1.txt"
V237 118_NOT 0 PWL file="C:\Users\User\Google Drive\Thesis_shared_folder\anik_thesis\simulations\pattern_with_memristor\pwm_files\R_N_118_1.txt"
V238 N483 0 PWL file="C:\Users\User\Google Drive\Thesis_shared_folder\anik_thesis\simulations\pattern_with_memristor\pwm_files\R_119_1.txt"
V239 119_NOT 0 PWL file="C:\Users\User\Google Drive\Thesis_shared_folder\anik_thesis\simulations\pattern_with_memristor\pwm_files\R_N_119_1.txt"
V240 N487 0 PWL file="C:\Users\User\Google Drive\Thesis_shared_folder\anik_thesis\simulations\pattern_with_memristor\pwm_files\R_120_1.txt"
V241 120_NOT 0 PWL file="C:\Users\User\Google Drive\Thesis_shared_folder\anik_thesis\simulations\pattern_with_memristor\pwm_files\R_N_120_1.txt"
V242 N491 0 PWL file="C:\Users\User\Google Drive\Thesis_shared_folder\anik_thesis\simulations\pattern_with_memristor\pwm_files\R_121_1.txt"
V243 121_NOT 0 PWL file="C:\Users\User\Google Drive\Thesis_shared_folder\anik_thesis\simulations\pattern_with_memristor\pwm_files\R_N_121_1.txt"
V244 N495 0 PWL file="C:\Users\User\Google Drive\Thesis_shared_folder\anik_thesis\simulations\pattern_with_memristor\pwm_files\R_122_1.txt"
V245 122_NOT 0 PWL file="C:\Users\User\Google Drive\Thesis_shared_folder\anik_thesis\simulations\pattern_with_memristor\pwm_files\R_N_122_1.txt"
V246 N499 NC_12 PWL file="C:\Users\User\Google Drive\Thesis_shared_folder\anik_thesis\simulations\pattern_with_memristor\pwm_files\R_123_1.txt"
V247 123_NOT NC_13 PWL file="C:\Users\User\Google Drive\Thesis_shared_folder\anik_thesis\simulations\pattern_with_memristor\pwm_files\R_N_123_1.txt"
V248 N503 0 PWL file="C:\Users\User\Google Drive\Thesis_shared_folder\anik_thesis\simulations\pattern_with_memristor\pwm_files\R_124_1.txt"
V249 124_NOT 0 PWL file="C:\Users\User\Google Drive\Thesis_shared_folder\anik_thesis\simulations\pattern_with_memristor\pwm_files\R_N_124_1.txt"
V250 N507 0 PWL file="C:\Users\User\Google Drive\Thesis_shared_folder\anik_thesis\simulations\pattern_with_memristor\pwm_files\R_125_1.txt"
V251 125_NOT 0 PWL file="C:\Users\User\Google Drive\Thesis_shared_folder\anik_thesis\simulations\pattern_with_memristor\pwm_files\R_N_125_1.txt"
V252 N511 NC_14 PWL file="C:\Users\User\Google Drive\Thesis_shared_folder\anik_thesis\simulations\pattern_with_memristor\pwm_files\R_126_1.txt"
V253 126_NOT 0 PWL file="C:\Users\User\Google Drive\Thesis_shared_folder\anik_thesis\simulations\pattern_with_memristor\pwm_files\R_N_126_1.txt"
V254 N515 0 PWL file="C:\Users\User\Google Drive\Thesis_shared_folder\anik_thesis\simulations\pattern_with_memristor\pwm_files\R_127_1.txt"
V255 127_NOT 0 PWL file="C:\Users\User\Google Drive\Thesis_shared_folder\anik_thesis\simulations\pattern_with_memristor\pwm_files\R_N_127_1.txt"
V256 N519 0 PWL file="C:\Users\User\Google Drive\Thesis_shared_folder\anik_thesis\simulations\pattern_with_memristor\pwm_files\R_128_1.txt"
V257 128_NOT 0 PWL file="C:\Users\User\Google Drive\Thesis_shared_folder\anik_thesis\simulations\pattern_with_memristor\pwm_files\R_N_128_1.txt"
V258 N523 0 PWL file="C:\Users\User\Google Drive\Thesis_shared_folder\anik_thesis\simulations\pattern_with_memristor\pwm_files\R_129_1.txt"
V259 129_NOT 0 PWL file="C:\Users\User\Google Drive\Thesis_shared_folder\anik_thesis\simulations\pattern_with_memristor\pwm_files\R_N_129_1.txt"
V260 N527 0 PWL file="C:\Users\User\Google Drive\Thesis_shared_folder\anik_thesis\simulations\pattern_with_memristor\pwm_files\R_130_1.txt"
V261 130_NOT 0 PWL file="C:\Users\User\Google Drive\Thesis_shared_folder\anik_thesis\simulations\pattern_with_memristor\pwm_files\R_N_130_1.txt"
V262 N531 0 PWL file="C:\Users\User\Google Drive\Thesis_shared_folder\anik_thesis\simulations\pattern_with_memristor\pwm_files\R_131_1.txt"
V263 131_NOT 0 PWL file="C:\Users\User\Google Drive\Thesis_shared_folder\anik_thesis\simulations\pattern_with_memristor\pwm_files\R_N_131_1.txt"
V264 N535 0 PWL file="C:\Users\User\Google Drive\Thesis_shared_folder\anik_thesis\simulations\pattern_with_memristor\pwm_files\R_132_1.txt"
V265 132_NOT 0 PWL file="C:\Users\User\Google Drive\Thesis_shared_folder\anik_thesis\simulations\pattern_with_memristor\pwm_files\R_N_132_1.txt"
V266 N539 0 PWL file="C:\Users\User\Google Drive\Thesis_shared_folder\anik_thesis\simulations\pattern_with_memristor\pwm_files\R_133_1.txt"
V267 133_NOT 0 PWL file="C:\Users\User\Google Drive\Thesis_shared_folder\anik_thesis\simulations\pattern_with_memristor\pwm_files\R_N_133_1.txt"
V268 N543 0 PWL file="C:\Users\User\Google Drive\Thesis_shared_folder\anik_thesis\simulations\pattern_with_memristor\pwm_files\R_134_1.txt"
V269 134_NOT 0 PWL file="C:\Users\User\Google Drive\Thesis_shared_folder\anik_thesis\simulations\pattern_with_memristor\pwm_files\R_N_134_1.txt"
V270 N547 0 PWL file="C:\Users\User\Google Drive\Thesis_shared_folder\anik_thesis\simulations\pattern_with_memristor\pwm_files\R_135_1.txt"
V271 135_NOT 0 PWL file="C:\Users\User\Google Drive\Thesis_shared_folder\anik_thesis\simulations\pattern_with_memristor\pwm_files\R_N_135_1.txt"
V272 N551 0 PWL file="C:\Users\User\Google Drive\Thesis_shared_folder\anik_thesis\simulations\pattern_with_memristor\pwm_files\R_136_1.txt"
V273 136_NOT 0 PWL file="C:\Users\User\Google Drive\Thesis_shared_folder\anik_thesis\simulations\pattern_with_memristor\pwm_files\R_N_136_1.txt"
V274 N555 0 PWL file="C:\Users\User\Google Drive\Thesis_shared_folder\anik_thesis\simulations\pattern_with_memristor\pwm_files\R_137_1.txt"
V275 137_NOT 0 PWL file="C:\Users\User\Google Drive\Thesis_shared_folder\anik_thesis\simulations\pattern_with_memristor\pwm_files\R_N_137_1.txt"
V276 N559 0 PWL file="C:\Users\User\Google Drive\Thesis_shared_folder\anik_thesis\simulations\pattern_with_memristor\pwm_files\R_138_1.txt"
V277 138_NOT 0 PWL file="C:\Users\User\Google Drive\Thesis_shared_folder\anik_thesis\simulations\pattern_with_memristor\pwm_files\R_N_138_1.txt"
V278 N563 0 PWL file="C:\Users\User\Google Drive\Thesis_shared_folder\anik_thesis\simulations\pattern_with_memristor\pwm_files\R_139_1.txt"
V279 139_NOT 0 PWL file="C:\Users\User\Google Drive\Thesis_shared_folder\anik_thesis\simulations\pattern_with_memristor\pwm_files\R_N_139_1.txt"
V280 N567 0 PWL file="C:\Users\User\Google Drive\Thesis_shared_folder\anik_thesis\simulations\pattern_with_memristor\pwm_files\R_140_1.txt"
V281 140_NOT 0 PWL file="C:\Users\User\Google Drive\Thesis_shared_folder\anik_thesis\simulations\pattern_with_memristor\pwm_files\R_N_140_1.txt"
V282 N571 0 PWL file="C:\Users\User\Google Drive\Thesis_shared_folder\anik_thesis\simulations\pattern_with_memristor\pwm_files\R_141_1.txt"
V283 141_NOT 0 PWL file="C:\Users\User\Google Drive\Thesis_shared_folder\anik_thesis\simulations\pattern_with_memristor\pwm_files\R_N_141_1.txt"
V284 N575 0 PWL file="C:\Users\User\Google Drive\Thesis_shared_folder\anik_thesis\simulations\pattern_with_memristor\pwm_files\R_142_1.txt"
V285 142_NOT 0 PWL file="C:\Users\User\Google Drive\Thesis_shared_folder\anik_thesis\simulations\pattern_with_memristor\pwm_files\R_N_142_1.txt"
V286 N579 0 PWL file="C:\Users\User\Google Drive\Thesis_shared_folder\anik_thesis\simulations\pattern_with_memristor\pwm_files\R_143_1.txt"
V287 143_NOT 0 PWL file="C:\Users\User\Google Drive\Thesis_shared_folder\anik_thesis\simulations\pattern_with_memristor\pwm_files\R_N_143_1.txt"
V288 N583 0 PWL file="C:\Users\User\Google Drive\Thesis_shared_folder\anik_thesis\simulations\pattern_with_memristor\pwm_files\R_144_1.txt"
V289 144_NOT 0 PWL file="C:\Users\User\Google Drive\Thesis_shared_folder\anik_thesis\simulations\pattern_with_memristor\pwm_files\R_N_144_1.txt"
Xfifth_block N588 145_NOT N592 146_NOT N596 147_NOT N600 148_NOT N604 149_NOT N608 150_NOT N612 151_NOT N616 152_NOT N007 N620 153_NOT N624 154_NOT N628 155_NOT N632 156_NOT N636 157_NOT N640 158_NOT N644 159_NOT N648 160_NOT N652 161_NOT N656 162_NOT N660 163_NOT N664 164_NOT N668 165_NOT N672 166_NOT N676 167_NOT N680 168_NOT N684 169_NOT N688 170_NOT N692 171_NOT N696 172_NOT N700 173_NOT N704 174_NOT N708 175_NOT N712 176_NOT N716 177_NOT N720 178_NOT N724 179_NOT N727 180_NOT memristor_block
V290 N588 0 PWL file="C:\Users\User\Google Drive\Thesis_shared_folder\anik_thesis\simulations\pattern_with_memristor\pwm_files\R_145_1.txt"
V291 145_NOT 0 PWL file="C:\Users\User\Google Drive\Thesis_shared_folder\anik_thesis\simulations\pattern_with_memristor\pwm_files\R_N_145_1.txt"
V292 N592 0 PWL file="C:\Users\User\Google Drive\Thesis_shared_folder\anik_thesis\simulations\pattern_with_memristor\pwm_files\R_146_1.txt"
V293 146_NOT 0 PWL file="C:\Users\User\Google Drive\Thesis_shared_folder\anik_thesis\simulations\pattern_with_memristor\pwm_files\R_N_146_1.txt"
V294 N596 0 PWL file="C:\Users\User\Google Drive\Thesis_shared_folder\anik_thesis\simulations\pattern_with_memristor\pwm_files\R_147_1.txt"
V295 147_NOT 0 PWL file="C:\Users\User\Google Drive\Thesis_shared_folder\anik_thesis\simulations\pattern_with_memristor\pwm_files\R_N_147_1.txt"
V296 N600 0 PWL file="C:\Users\User\Google Drive\Thesis_shared_folder\anik_thesis\simulations\pattern_with_memristor\pwm_files\R_148_1.txt"
V297 148_NOT 0 PWL file="C:\Users\User\Google Drive\Thesis_shared_folder\anik_thesis\simulations\pattern_with_memristor\pwm_files\R_N_148_1.txt"
V298 N604 0 PWL file="C:\Users\User\Google Drive\Thesis_shared_folder\anik_thesis\simulations\pattern_with_memristor\pwm_files\R_149_1.txt"
V299 149_NOT 0 PWL file="C:\Users\User\Google Drive\Thesis_shared_folder\anik_thesis\simulations\pattern_with_memristor\pwm_files\R_N_149_1.txt"
V300 N608 0 PWL file="C:\Users\User\Google Drive\Thesis_shared_folder\anik_thesis\simulations\pattern_with_memristor\pwm_files\R_150_1.txt"
V301 150_NOT 0 PWL file="C:\Users\User\Google Drive\Thesis_shared_folder\anik_thesis\simulations\pattern_with_memristor\pwm_files\R_N_150_1.txt"
V302 N612 0 PWL file="C:\Users\User\Google Drive\Thesis_shared_folder\anik_thesis\simulations\pattern_with_memristor\pwm_files\R_151_1.txt"
V303 151_NOT 0 PWL file="C:\Users\User\Google Drive\Thesis_shared_folder\anik_thesis\simulations\pattern_with_memristor\pwm_files\R_N_151_1.txt"
V304 N616 0 PWL file="C:\Users\User\Google Drive\Thesis_shared_folder\anik_thesis\simulations\pattern_with_memristor\pwm_files\R_152_1.txt"
V305 152_NOT 0 PWL file="C:\Users\User\Google Drive\Thesis_shared_folder\anik_thesis\simulations\pattern_with_memristor\pwm_files\R_N_152_1.txt"
V306 N620 0 PWL file="C:\Users\User\Google Drive\Thesis_shared_folder\anik_thesis\simulations\pattern_with_memristor\pwm_files\R_153_1.txt"
V307 153_NOT 0 PWL file="C:\Users\User\Google Drive\Thesis_shared_folder\anik_thesis\simulations\pattern_with_memristor\pwm_files\R_N_153_1.txt"
V308 N624 0 PWL file="C:\Users\User\Google Drive\Thesis_shared_folder\anik_thesis\simulations\pattern_with_memristor\pwm_files\R_154_1.txt"
V309 154_NOT 0 PWL file="C:\Users\User\Google Drive\Thesis_shared_folder\anik_thesis\simulations\pattern_with_memristor\pwm_files\R_N_154_1.txt"
V310 N628 0 PWL file="C:\Users\User\Google Drive\Thesis_shared_folder\anik_thesis\simulations\pattern_with_memristor\pwm_files\R_155_1.txt"
V311 155_NOT 0 PWL file="C:\Users\User\Google Drive\Thesis_shared_folder\anik_thesis\simulations\pattern_with_memristor\pwm_files\R_N_155_1.txt"
V312 N632 0 PWL file="C:\Users\User\Google Drive\Thesis_shared_folder\anik_thesis\simulations\pattern_with_memristor\pwm_files\R_156_1.txt"
V313 156_NOT 0 PWL file="C:\Users\User\Google Drive\Thesis_shared_folder\anik_thesis\simulations\pattern_with_memristor\pwm_files\R_N_156_1.txt"
V314 N636 0 PWL file="C:\Users\User\Google Drive\Thesis_shared_folder\anik_thesis\simulations\pattern_with_memristor\pwm_files\R_157_1.txt"
V315 157_NOT 0 PWL file="C:\Users\User\Google Drive\Thesis_shared_folder\anik_thesis\simulations\pattern_with_memristor\pwm_files\R_N_157_1.txt"
V316 N640 0 PWL file="C:\Users\User\Google Drive\Thesis_shared_folder\anik_thesis\simulations\pattern_with_memristor\pwm_files\R_158_1.txt"
V317 158_NOT 0 PWL file="C:\Users\User\Google Drive\Thesis_shared_folder\anik_thesis\simulations\pattern_with_memristor\pwm_files\R_N_158_1.txt"
V318 N644 NC_15 PWL file="C:\Users\User\Google Drive\Thesis_shared_folder\anik_thesis\simulations\pattern_with_memristor\pwm_files\R_159_1.txt"
V319 159_NOT NC_16 PWL file="C:\Users\User\Google Drive\Thesis_shared_folder\anik_thesis\simulations\pattern_with_memristor\pwm_files\R_N_159_1.txt"
V320 N648 0 PWL file="C:\Users\User\Google Drive\Thesis_shared_folder\anik_thesis\simulations\pattern_with_memristor\pwm_files\R_159_1.txt"
V321 160_NOT 0 PWL file="C:\Users\User\Google Drive\Thesis_shared_folder\anik_thesis\simulations\pattern_with_memristor\pwm_files\R_N_160_1.txt"
V322 N652 0 PWL file="C:\Users\User\Google Drive\Thesis_shared_folder\anik_thesis\simulations\pattern_with_memristor\pwm_files\R_161_1.txt"
V323 161_NOT 0 PWL file="C:\Users\User\Google Drive\Thesis_shared_folder\anik_thesis\simulations\pattern_with_memristor\pwm_files\R_N_162_1.txt"
V324 N656 NC_17 PWL file="C:\Users\User\Google Drive\Thesis_shared_folder\anik_thesis\simulations\pattern_with_memristor\pwm_files\R_162_1.txt"
V325 162_NOT 0 PWL file="C:\Users\User\Google Drive\Thesis_shared_folder\anik_thesis\simulations\pattern_with_memristor\pwm_files\R_N_162_1.txt"
V326 N660 0 PWL file="C:\Users\User\Google Drive\Thesis_shared_folder\anik_thesis\simulations\pattern_with_memristor\pwm_files\R_163_1.txt"
V327 163_NOT 0 PWL file="C:\Users\User\Google Drive\Thesis_shared_folder\anik_thesis\simulations\pattern_with_memristor\pwm_files\R_N_163_1.txt"
V328 N664 0 PWL file="C:\Users\User\Google Drive\Thesis_shared_folder\anik_thesis\simulations\pattern_with_memristor\pwm_files\R_164_1.txt"